# EAGLE design VocoreMotorShieldDRV8835 (EAGLE 6.5.0)
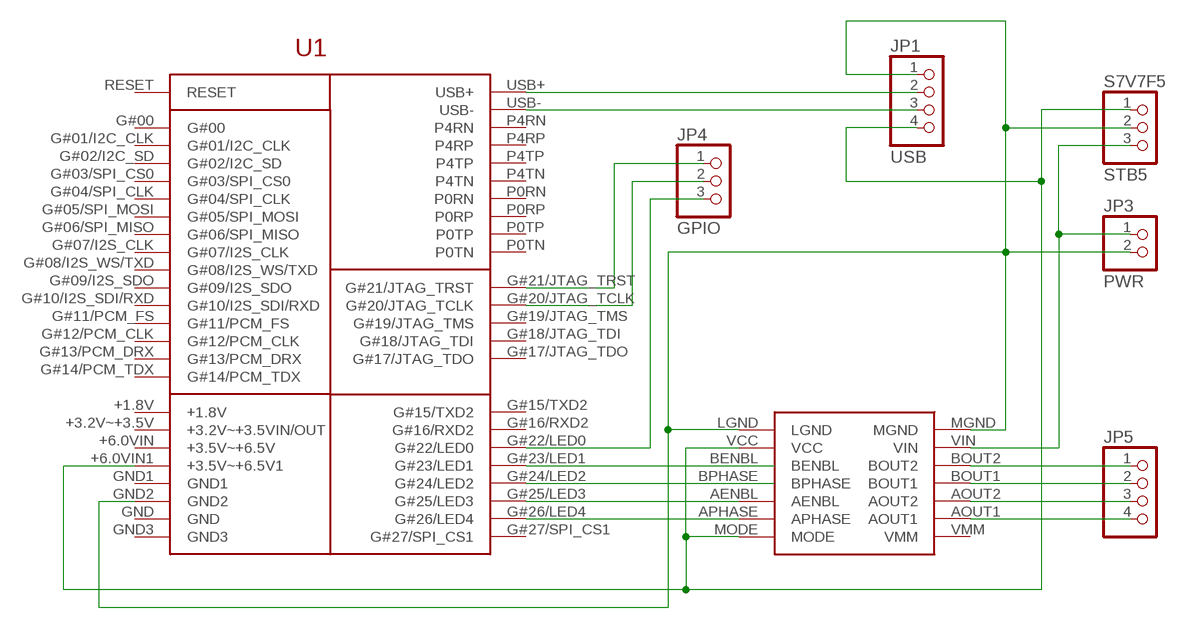
[diagram p0: schematic, sheet 1]

## Parts
JP1  USB  PINHD-1X4  [1X04]
JP3  PWR  PINHD-1X2  [1X02]
JP4  GPIO  PINHD-1X3  [1X03]
JP5  PINHD-1X4  [1X04]
S7V7F5  STB5  PINHD-1X3  [1X03]
U1  VOCORE_SHIELD  [VOCORE_DOC_CUSTOM]
U$1  POLOLU_MOTOR_DRV8835THROUGHHOLE  [POLOLU_MOTOR_DRV_DRV8835]

## Nets
N$1: JP1.1 JP3.2 S7V7F5.2 U1.GND2 U$1.LGND U$1.MGND
N$2: JP3.1 S7V7F5.3 U$1.VIN
N$3: JP1.4 S7V7F5.1 U1.+6.0VIN1(+3.5V~+6.5V1) U$1.MODE U$1.VCC
N$4: U1.G#23/LED1 U$1.BENBL
N$5: JP1.3 U1.USB-
N$6: JP1.2 U1.USB+
N$7: U1.G#24/LED2 U$1.BPHASE
N$8: U1.G#25/LED3 U$1.AENBL
N$9: U1.G#26/LED4 U$1.APHASE
N$10: JP5.1 U$1.BOUT2
N$11: JP5.4 U$1.AOUT1
N$12: JP4.2 U1.G#20/JTAG_TCLK
N$13: JP5.3 U$1.AOUT2
N$14: JP5.2 U$1.BOUT1
N$15: JP4.3 U1.G#22/LED0
N$16: JP4.1 U1.G#21/JTAG_TRST
Unconnected: U1.+1.8V U1.+3.2V~+3.5V(+3.2V~+3.5VIN/OUT) U1.+6.0VIN(+3.5V~+6.5V) U1.G#00 U1.G#01/I2C_CLK U1.G#02/I2C_SD U1.G#03/SPI_CS0 U1.G#04/SPI_CLK U1.G#05/SPI_MOSI U1.G#06/SPI_MISO U1.G#07/I2S_CLK U1.G#08/I2S_WS/TXD U1.G#09/I2S_SDO U1.G#10/I2S_SDI/RXD U1.G#11/PCM_FS U1.G#12/PCM_CLK U1.G#13/PCM_DRX U1.G#14/PCM_TDX U1.G#15/TXD2 U1.G#16/RXD2 U1.G#17/JTAG_TDO U1.G#18/JTAG_TDI U1.G#19/JTAG_TMS U1.G#27/SPI_CS1 U1.GND U1.GND1 U1.GND3 U1.P0RN U1.P0RP U1.P0TN U1.P0TP U1.P4RN U1.P4RP U1.P4TN U1.P4TP U1.RESET U$1.VMM

## Library data of the parts
JP1 JP5 = pinheaders:PINHD-1X4: PIN HEADER
JP3 = pinheaders:PINHD-1X2: PIN HEADER
JP4 S7V7F5 = pinheaders:PINHD-1X3: PIN HEADER
U1 = Vocore:VOCORE_SHIELD
U$1 = pololu:POLOLU_MOTOR_DRV8835

## Board
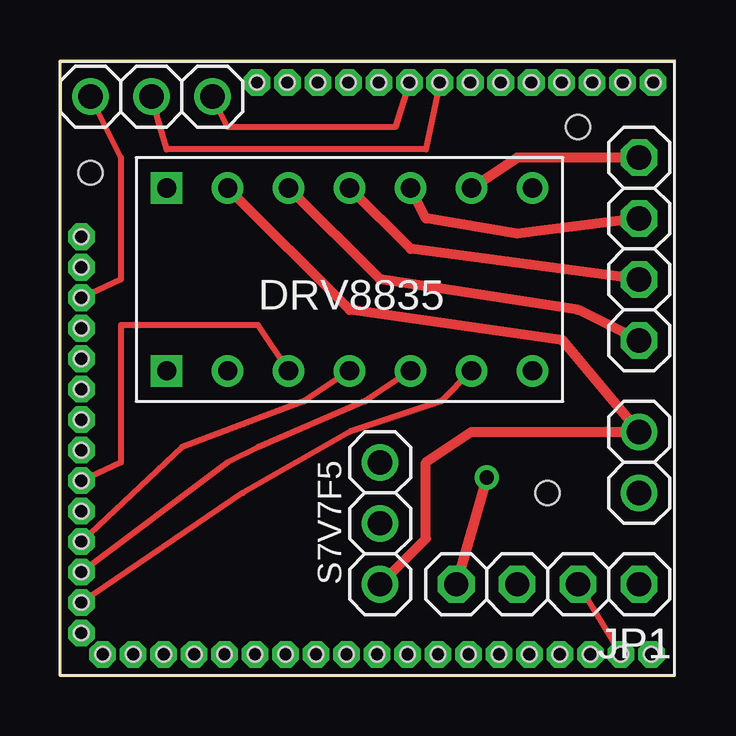
[diagram p1: board, top side]
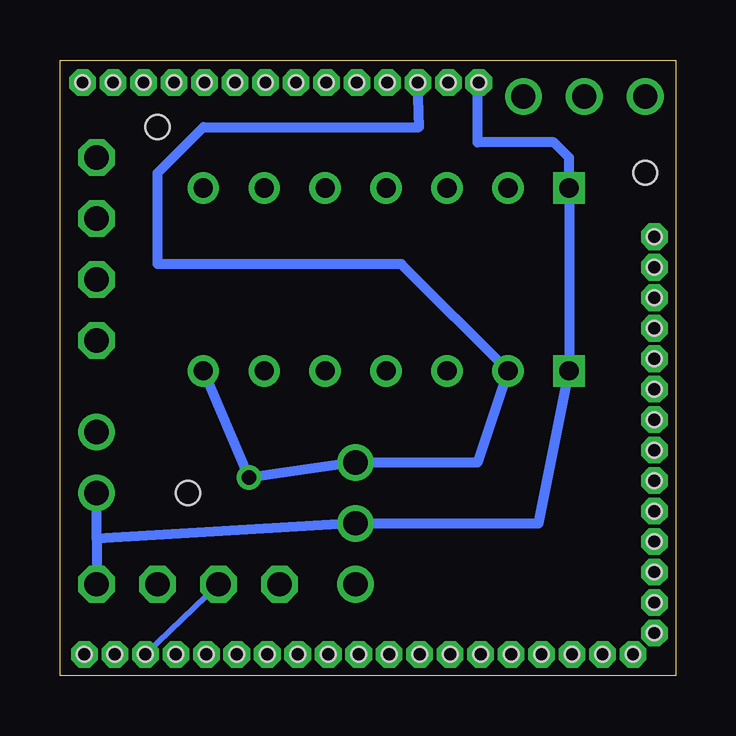
[diagram p2: board, bottom side, seen from below]

Size 25.65 x 25.65 mm. Coordinates in mm from the lower left corner, seen from the top.
Outline: 0,0 25.65,0 25.65,25.65 0,25.65 0,0
Copper layers (1*16): Top 0.035mm / dielectric 1.5mm / Bottom 0.035mm
Design rules "default": minimum track width 10mil, minimum drill 24mil, track to track 8mil, track to pad 8mil, pad to pad 8mil, via to via 8mil, smd to smd 8mil, copper to edge 40mil, drill to drill 8mil, minimum pad ring 10mil, minimum via ring 8mil, stop-mask expansion 4mil, vias tented up to drill 0mil, thermal gap 10mil
Holes 1 mm at 20.32,7.62 1.27,20.95 21.59,22.86

### Footprints (pad centres in the part's own frame; a part is rotated, then mirrored left to right if it is on the bottom)
1X04 = drill 1.016 octagon: 1 -3.81,0; 2 -1.27,0; 3 1.27,0; 4 3.81,0
1X02 = drill 1.016: 1 -1.27,0; 2 1.27,0
1X03 = drill 1.016: 1 -2.54,0; 2 0,0; 3 2.54,0
VOCORE_DOC_CUSTOM = drill 0.6 pad 0.889 octagon: +1.8V 0.889,13.208; +3.2V~+3.5V 24.638,0.889; +6.0VIN 9.474,24.714; +6.0VIN1 10.744,24.714; G#00 18.364,24.714; G#01/I2C_CLK 20.904,24.714; G#02/I2C_SD 22.174,24.714; G#03/SPI_CS0 9.398,0.889; G#04/SPI_CLK 0.889,11.938; G#05/SPI_MOSI 0.889,10.668; G#06/SPI_MISO 8.128,0.889; G#07/I2S_CLK 4.318,0.889; G#08/I2S_WS/TXD 0.889,14.478; G#09/I2S_SDO 0.889,17.018; G#10/I2S_SDI/RXD 6.858,0.889; G#11/PCM_FS 10.668,0.889; G#12/PCM_CLK 0.889,18.288; G#13/PCM_DRX 0.889,6.858; G#14/PCM_TDX 0.889,1.778; G#15/TXD2 3.048,0.889; G#16/RXD2 5.588,0.889; G#17/JTAG_TDO 13.284,24.714; G#18/JTAG_TDI 19.634,24.714; G#19/JTAG_TMS 17.094,24.714; G#20/JTAG_TCLK 15.824,24.714; G#21/JTAG_TRST 14.554,24.714; G#22/LED0 0.889,15.748; G#23/LED1 0.889,8.128; G#24/LED2 0.889,5.588; G#25/LED3 0.889,4.318; G#26/LED4 0.889,3.048; G#27/SPI_CS1 0.889,9.398; GND 24.714,24.714; GND1 12.014,24.714; GND2 8.204,24.714; GND3 1.778,0.889; P0RN 15.748,0.889; P0RP 14.478,0.889; P0TN 11.938,0.889; P0TP 13.208,0.889; P4RN 20.828,0.889; P4RP 19.558,0.889; P4TN 17.018,0.889; P4TP 18.288,0.889; RESET 23.444,24.714; USB+ 23.368,0.889; USB- 22.098,0.889 | hole 0.6: 0.889,1.778; 0.889,3.048; 0.889,4.318; 0.889,5.588; 0.889,6.858; 0.889,8.128; 0.889,9.398; 0.889,10.668; 0.889,11.938; 0.889,13.208; 0.889,14.478; 0.889,15.748; 0.889,17.018; 0.889,18.288; 8.204,24.714; 24.714,24.714; 23.444,24.714; 22.174,24.714; 20.904,24.714; 19.634,24.714; 18.364,24.714; 17.094,24.714; 15.824,24.714; 14.554,24.714; 13.284,24.714; 12.014,24.714; 10.744,24.714; 9.474,24.714; 1.778,0.889; 18.288,0.889; 17.018,0.889; 15.748,0.889; 14.478,0.889; 13.208,0.889; 11.938,0.889; 10.668,0.889; 9.398,0.889; 8.128,0.889; 6.858,0.889; 5.588,0.889; 4.318,0.889; 3.048,0.889; 24.638,0.889; 23.368,0.889; 22.098,0.889; 20.828,0.889; 19.558,0.889
POLOLU_MOTOR_DRV_DRV8835 = drill 0.8: AENBL 1.27,6.35; AOUT1 8.89,3.81; AOUT2 8.89,6.35; APHASE 1.27,3.81; BENBL 1.27,11.43; BOUT1 8.89,8.89; BOUT2 8.89,11.43; BPHASE 1.27,8.89; MODE 1.27,1.27; VCC 1.27,13.97; VIN 8.89,13.97; VMM 8.89,1.27 | drill 0.8 square: LGND 1.27,16.51; MGND 8.89,16.51

### Placement (x,y rotation side)
JP1  20.32,3.81 180 top
JP3  24.13,8.89 270 top
JP4  3.81,24.13 180 top
JP5  24.13,17.78 90 top
S7V7F5  13.34,6.35 270 top
U1  0,0 0 top
U$1  20.95,11.43 90 top

### Tracks (layer width: path | path; a pad name or v marks a point on that pad's centre or on a via)
N$1
  Bottom 0.406: 24.13,5.71 JP1.1 | 24.13,5.71 S7V7F5.2 5.71,6.35 U$1.LGND U$1.MGND 4.45,21.59 5.08,22.23 8.26,22.23 8.26,24.66 U1.GND2 | 24.13,5.71 JP3.2
N$2
  Top 0.406: U$1.VIN 12.06,15.24 20.95,13.97 JP3.1 17.14,10.16 15.24,8.89 15.24,5.71 S7V7F5.3
N$3  (via drill 0.6)
  Top 0.406: v17.78,8.26 JP1.4
  Bottom 0.406: U$1.MODE v17.78,8.26 S7V7F5.1 8.26,8.89 U$1.VCC 11.43,17.14 21.59,17.14 21.59,20.95 19.68,22.86 10.69,22.86 U1.+6.0VIN1
N$4
  Top 0.254: U$1.BENBL 8.26,14.61 2.54,14.61 2.54,8.89 U1.G#23/LED1
N$5
  Bottom 0.254: JP1.3 U1.USB-
N$6
  Top 0.254: JP1.2 U1.USB+
N$7
  Top 0.254: U$1.BPHASE 10.16,11.43 5.08,9.53 U1.G#24/LED2
N$8
  Top 0.254: U$1.AENBL 12.7,11.43 8.26,9.53 6.99,8.89 U1.G#25/LED3
N$9
  Top 0.254: U$1.APHASE 15.88,11.43 12.06,10.16 7.62,7.62 U1.G#26/LED4
N$10
  Top 0.406: U$1.BOUT2 13.34,16.51 21.59,15.24 JP5.1
N$11
  Top 0.406: U$1.AOUT1 19.05,21.59 JP5.4
N$12
  Top 0.254: U1.G#20/JTAG_TCLK 15.24,21.93 4.45,21.93 JP4.2
N$13
  Top 0.406: U$1.AOUT2 15.24,19.05 19.05,18.41 JP5.3
N$14
  Top 0.406: U$1.BOUT1 14.61,17.78 JP5.2
N$15
  Top 0.254: JP4.3 2.54,21.59 2.54,16.51 U1.G#22/LED0
N$16
  Top 0.254: U1.G#21/JTAG_TRST 13.97,22.86 6.99,22.86 JP4.1

### Text on the board
tValues: G22 | G20 | G21 | M1 | M2 | GND | M1 | GND | + | OUT | GND | GND | GND | IN | GND